# Altium schematic sheet Sheet2.SchDoc
size A4; Organization: Altium Limited; Address1: L3, 12a Rodborough Rd; Address2: Frenchs Forest; Address3: NSW; Address4: Australia 2086; PageSetup: Record=PageOptions|CenterHorizontal=True|CenterVertical=True|PrintScale=1.00|XCorrection=1.00|YCorrection=1.00|PrintKind=1|BorderSize=5000000|LeftOffset=0|BottomOffset=0|Orientation=2|PaperLength=1000|PaperWidth=1000|Scale=100|PaperSource=7|PrintQuality=600|MediaType=1|DitherType=10|PrintScaleMode=1|PaperKind=A4|PaperIndex=9
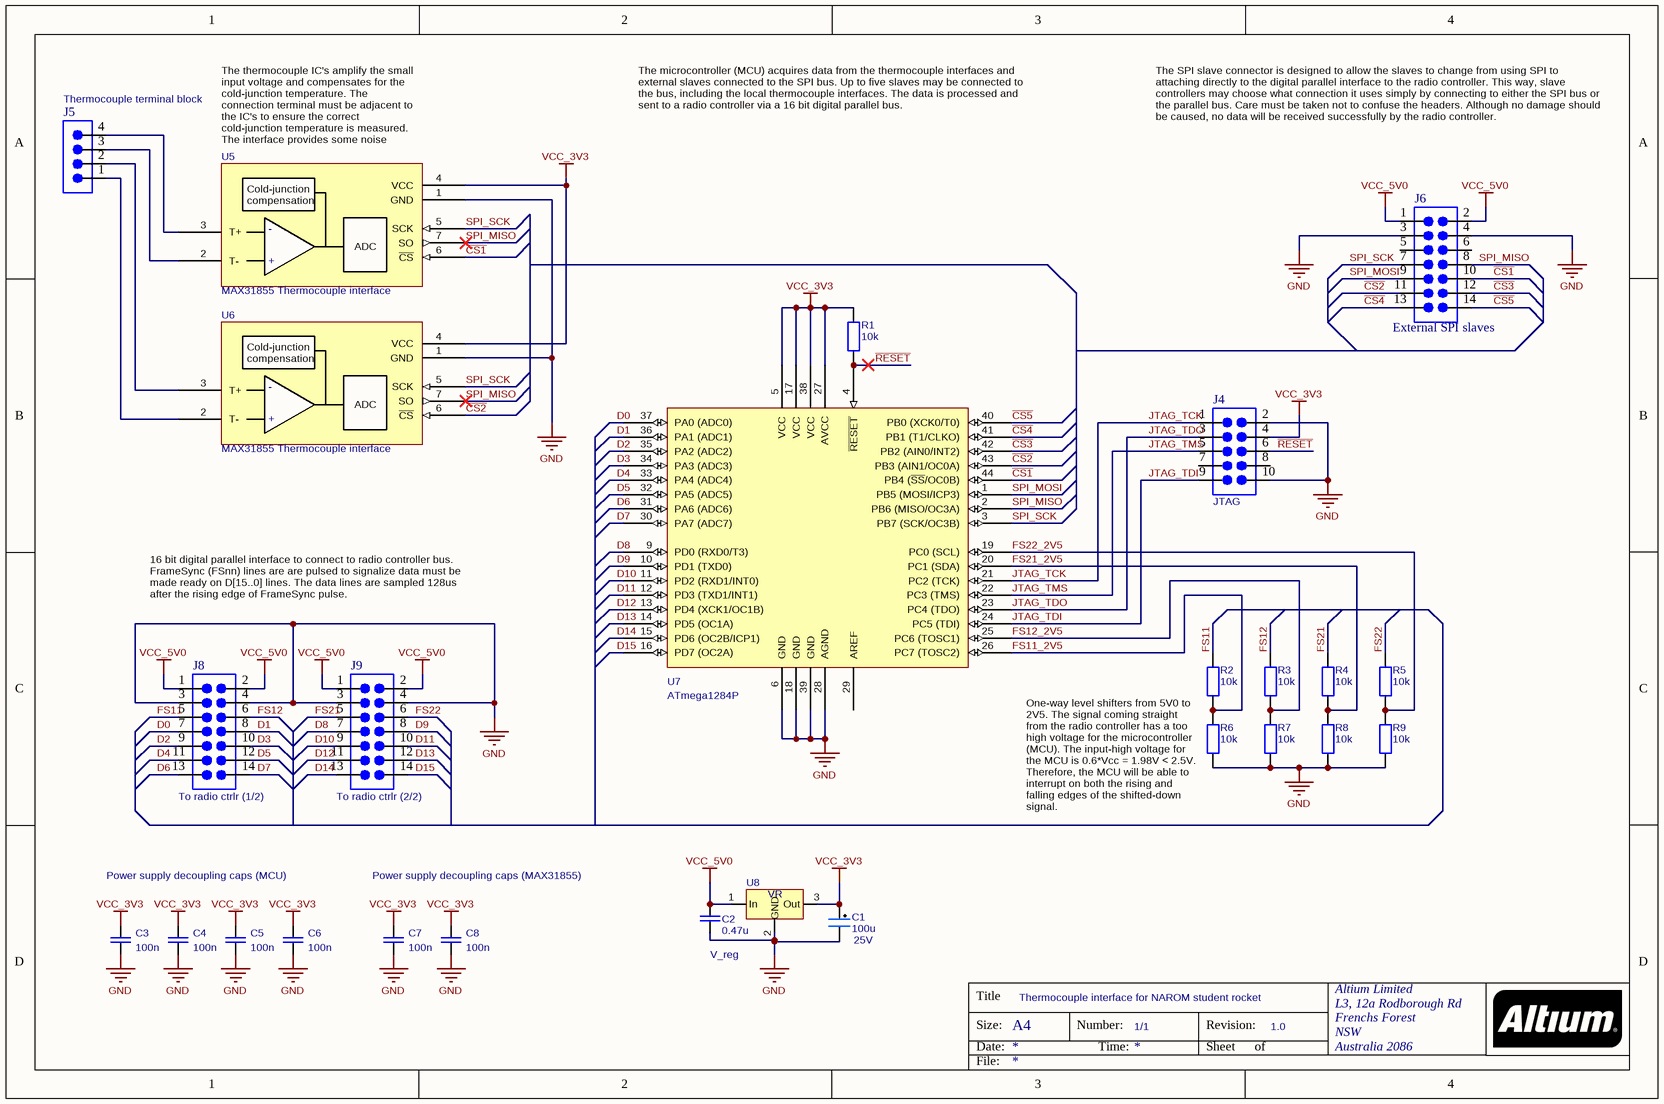
[diagram p0: Sheet2.SchDoc]

## Parts
C1  100u  Voltage rating: 25V  [cap_alu_electrolyte_size_code_e]
C2  0.47u  [cap_0603_standard]
C3  100n  [cap_0603_standard]
C4  100n  [cap_0603_standard]
C5  100n  [cap_0603_standard]
C6  100n  [cap_0603_standard]
C7  100n  [cap_0603_standard]
C8  100n  [cap_0603_standard]
J4  JTAG  [SHF-105-01-X-D-SM]
J5  Thermocouple terminal block  [con_harting_spring_cage_4way]
J6  External SPI slaves  [con_datamate_2row_14pin]
J8  To radio ctrlr (1/2)  [con_datamate_2row_14pin]
J9  To radio ctrlr (2/2)  [con_datamate_2row_14pin]
R1  10k  [res_0603_standard]
R2  10k  [res_0603_standard]
R3  10k  [res_0603_standard]
R4  10k  [res_0603_standard]
R5  10k  [res_0603_standard]
R6  10k  [res_0603_standard]
R7  10k  [res_0603_standard]
R8  10k  [res_0603_standard]
R9  10k  [res_0603_standard]
U5  MAX31855 Thermocouple interface  [SO8_N]
U6  MAX31855 Thermocouple interface  [SO8_N]
U7  ATmega1284P  [ATmega1284P-AU]
U8  V_reg  [ic_lin_reg_lm3940_sot223]

## Nets
GND: C1.2 C2.1 C3.1 C4.1 C5.1 C6.1 C7.1 C8.1 J4.2 J4.10 J6.3 J6.4 J8.3 J8.4 J9.3 J9.4 R6.2 R7.2 R8.2 R9.2 U5.1(GND) U6.1(GND) U7.6(GND) U7.18(GND) U7.28(AGND) U7.39(GND) U8.2(GND)
VCC_3V3: C1.1 C3.2 C4.2 C5.2 C6.2 C7.2 C8.2 J4.4 R1.1 U5.4(VCC) U6.4(VCC) U7.5(VCC) U7.17(VCC) U7.27(AVCC) U7.38(VCC) U8.3(Out)
VCC_5V0: C2.2 J6.1 J6.2 J8.1 J8.2 J9.1 J9.2 U8.1(In)
~{CS1}: J6.10 U5.6(~{CS}) U7.44(PB4_(~{SS}/OC0B))
~{CS2}: J6.11 U6.6(~{CS}) U7.43(PB3_(AIN1/OC0A))
~{CS3}: J6.12 U7.42(PB2_(AIN0/INT2))
~{CS4}: J6.13 U7.41(PB1_(T1/CLKO))
~{CS5}: J6.14 U7.40(PB0_(XCK0/T0))
D0: J8.7 U7.37(PA0_(ADC0))
D1: J8.8 U7.36(PA1_(ADC1))
D2: J8.9 U7.35(PA2_(ADC2))
D3: J8.10 U7.34(PA3_(ADC3))
D4: J8.11 U7.33(PA4_(ADC4))
D5: J8.12 U7.32(PA5_(ADC5))
D6: J8.13 U7.31(PA6_(ADC6))
D7: J8.14 U7.30(PA7_(ADC7))
D8: J9.7 U7.9(PD0_(RXD0/T3))
D9: J9.8 U7.10(PD1_(TXD0))
D10: J9.9 U7.11(PD2_(RXD1/INT0))
D11: J9.10 U7.12(PD3_(TXD1/INT1))
D12: J9.11 U7.13(PD4_(XCK1/OC1B))
D13: J9.12 U7.14(PD5_(OC1A))
D14: J9.13 U7.15(PD6_(OC2B/ICP1))
D15: J9.14 U7.16(PD7_(OC2A))
FS11: J8.5 R2.1
FS11_2V5: R2.2 R6.1 U7.26(PC7_(TOSC2))
FS12: J8.6 R3.1
FS12_2V5: R3.2 R7.1 U7.25(PC6_(TOSC1))
FS21: J9.5 R4.1
FS21_2V5: R4.2 R8.1 U7.20(PC1_(SDA))
FS22: J9.6 R5.1
FS22_2V5: R5.2 R9.1 U7.19(PC0_(SCL))
JTAG_TCK: J4.1 U7.21(PC2_(TCK))
JTAG_TDI: J4.9 U7.24(PC5_(TDI))
JTAG_TDO: J4.3 U7.23(PC4_(TDO))
JTAG_TMS: J4.5 U7.22(PC3_(TMS))
~{RESET}: J4.6 R1.2 U7.4(~{RESET})
SPI_MISO: J6.8 U5.7(SO) U6.7(SO) U7.2(PB6_(MISO/OC3A))
SPI_MOSI: J6.9 U7.1(PB5_(MOSI/ICP3))
SPI_SCK: J6.7 U5.5(SCK) U6.5(SCK) U7.3(PB7_(SCK/OC3B))
NetJ5_1: J5.1 U6.2(T-)
NetJ5_2: J5.2 U6.3(T+)
NetJ5_3: J5.3 U5.2(T-)
NetJ5_4: J5.4 U5.3(T+)

Not connected (* = marked no-connect by the designer): J4 7 8; J6 5 6; U7 29(AREF)

## Notes on the sheet
- (near U5) The thermocouple IC's amplify the small input voltage and compensates for the cold-junction temperature. The connection terminal must be adjacent to the IC's to ensure the correct cold-junction temperature is measured. The interface provides some noise reduction.
- The SPI slave connector is designed to allow the slaves to change from using SPI to attaching directly to the digital parallel interface to the radio controller. This way, slave controllers may choose what connection it uses simply by connecting to either the SPI bus or the parallel bus. Care must be taken not to confuse the headers. Although no damage should be caused, no data will be received successfully by the radio controller.
- The microcontroller (MCU) acquires data from the thermocouple interfaces and external slaves connected to the SPI bus. Up to five slaves may be connected to the bus, including the local thermocouple interfaces. The data is processed and sent to a radio controller via a 16 bit digital parallel bus.
- 16 bit digital parallel interface to connect to radio controller bus. FrameSync (FSnn) lines are are pulsed to signalize data must be made ready on D[15..0] lines. The data lines are sampled 128us after the rising edge of FrameSync pulse.
- One-way level shifters from 5V0 to 2V5. The signal coming straight from the radio controller has a too high voltage for the microcontroller (MCU). The input-high voltage for the MCU is 0.6*Vcc = 1.98V < 2.5V. Therefore, the MCU will be able to interrupt on both the rising and falling edges of the shifted-down signal.
- Power supply decoupling caps (MCU)
- Power supply decoupling caps (MAX31855)
- Thermocouple interface for NAROM student rocket
- 1/1
- 1.0
- Title
- Size:
- Date:
- A4
- Number:
- Time:
- Revision:
- Sheet
- of
- File:
- (in symbol ic_lin_vreg_LM78xx) VR
- (in symbol ic_maxim_max31855_thermocouple_interface_simplified) Cold-junction / compensation; -; ADC; +

## Library data of the parts
C1 = cap_genCap_polar: Generic polar capacitor; Value: 100u
C2-C8 = cap__genCapUnipol: Generic unipolarised capasitor; Voltage rating: ? V
  C2: Value: 0.47u
  C3-C8: Value: 100n
J4 = con_head_2x05pin: Header 2x5pin
J5 = con_head_1x04pin: Header 1x4pin
J6 J8 J9 = con_head_2x07pin: Header 2x7pin
R1-R9 = res__genResistor: Generic resistor; Watt rating: ? mW; Value: 10k
U5 U6 = ic_maxim_max31855_thermocouple_interface_simplified: Maxim MAX31855 thermocouple interface
U7 = ic_atmel_atmega1284p_tqfp: Atmel AVR 8 bit microcontroller
U8 = ic_lin_vreg_LM78xx: Positive voltage regulator 78xx